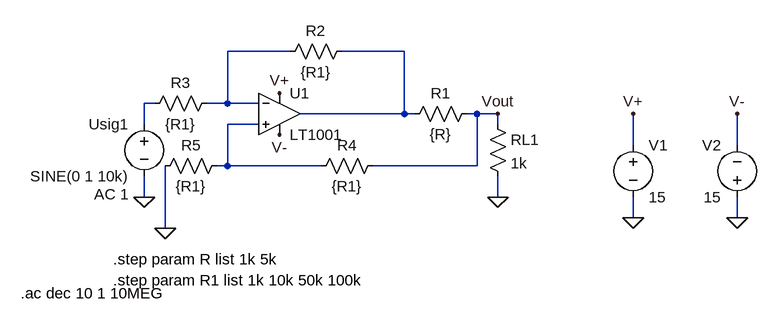
[diagram p0: schematic meros 3o C).asc]
meros 3o C).asc, the LTspice schematic file:
Version 4
SHEET 1 880 680
WIRE -48 96 -144 96
WIRE 128 96 32 96
WIRE -256 176 -272 176
WIRE -144 176 -144 96
WIRE -144 176 -176 176
WIRE -96 176 -144 176
WIRE 128 192 128 96
WIRE 128 192 -32 192
WIRE 144 192 128 192
WIRE 240 192 224 192
WIRE 272 192 240 192
WIRE -272 208 -272 176
WIRE -96 208 -144 208
WIRE 272 208 272 192
WIRE 480 240 480 192
WIRE 640 240 640 192
WIRE -144 272 -144 208
WIRE -144 272 -160 272
WIRE 0 272 -144 272
WIRE 240 272 240 192
WIRE 240 272 80 272
WIRE -272 320 -272 288
WIRE 272 320 272 288
WIRE 480 352 480 320
WIRE 640 352 640 320
WIRE -240 368 -240 272
FLAG -272 320 0
FLAG 272 320 0
FLAG -240 368 0
FLAG 480 352 0
FLAG 640 352 0
FLAG 480 192 V+
FLAG -64 160 V+
FLAG 640 192 V-
FLAG -64 224 V-
FLAG 272 192 Vout
SYMBOL OpAmps\\LT1001 -64 128 R0
SYMATTR InstName U1
SYMBOL res 240 176 R90
WINDOW 0 0 56 VBottom 2
WINDOW 3 32 56 VTop 2
SYMATTR InstName R1
SYMATTR Value {R}
SYMBOL res 48 80 R90
WINDOW 0 0 56 VBottom 2
WINDOW 3 32 56 VTop 2
SYMATTR InstName R2
SYMATTR Value {R1}
SYMBOL res -160 160 R90
WINDOW 0 0 56 VBottom 2
WINDOW 3 32 56 VTop 2
SYMATTR InstName R3
SYMATTR Value {R1}
SYMBOL res 256 192 R0
SYMATTR InstName RL1
SYMATTR Value 1k
SYMBOL res 96 256 R90
WINDOW 0 0 56 VBottom 2
WINDOW 3 32 56 VTop 2
SYMATTR InstName R4
SYMATTR Value {R1}
SYMBOL res -144 256 R90
WINDOW 0 0 56 VBottom 2
WINDOW 3 32 56 VTop 2
SYMATTR InstName R5
SYMATTR Value {R1}
SYMBOL voltage -272 192 M0
WINDOW 123 24 124 Left 2
WINDOW 39 0 0 Left 0
SYMATTR Value2 AC 1
SYMATTR InstName Usig1
SYMATTR Value SINE(0 1 10k)
SYMBOL voltage 480 224 R0
WINDOW 123 0 0 Left 0
WINDOW 39 0 0 Left 0
SYMATTR InstName V1
SYMATTR Value 15
SYMBOL voltage 640 336 R180
WINDOW 0 24 96 Left 2
WINDOW 3 24 16 Left 2
WINDOW 123 0 0 Left 0
WINDOW 39 0 0 Left 0
SYMATTR InstName V2
SYMATTR Value 15
TEXT -320 416 Left 2 !.step param R list 1k 5k
TEXT -320 448 Left 2 !.step param R1 list 1k 10k 50k 100k
TEXT -462 468 Left 2 !.ac dec 10 1 10MEG

The netlist it stands for:
* meros 3o C).asc
XU1 N004 N001 V+ V- N002 LT1001  ; pins In+ In- V+ V- OUT
R1 Vout N002 {R}
R2 N002 N001 {R1}
R3 N001 N003 {R1}
RL1 Vout 0 1k
R4 Vout N004 {R1}
R5 N004 0 {R1}
V§Usig1 N003 0 SINE(0 1 10k) AC 1
V1 V+ 0 15
V2 0 V- 15
.step param R list 1k 5k
.step param R1 list 1k 10k 50k 100k
.ac dec 10 1 10MEG
.lib LTC.lib
.backanno
.end